# EAGLE board ControlBoardv1.3 (EAGLE 7.6.0), part 1 of 3
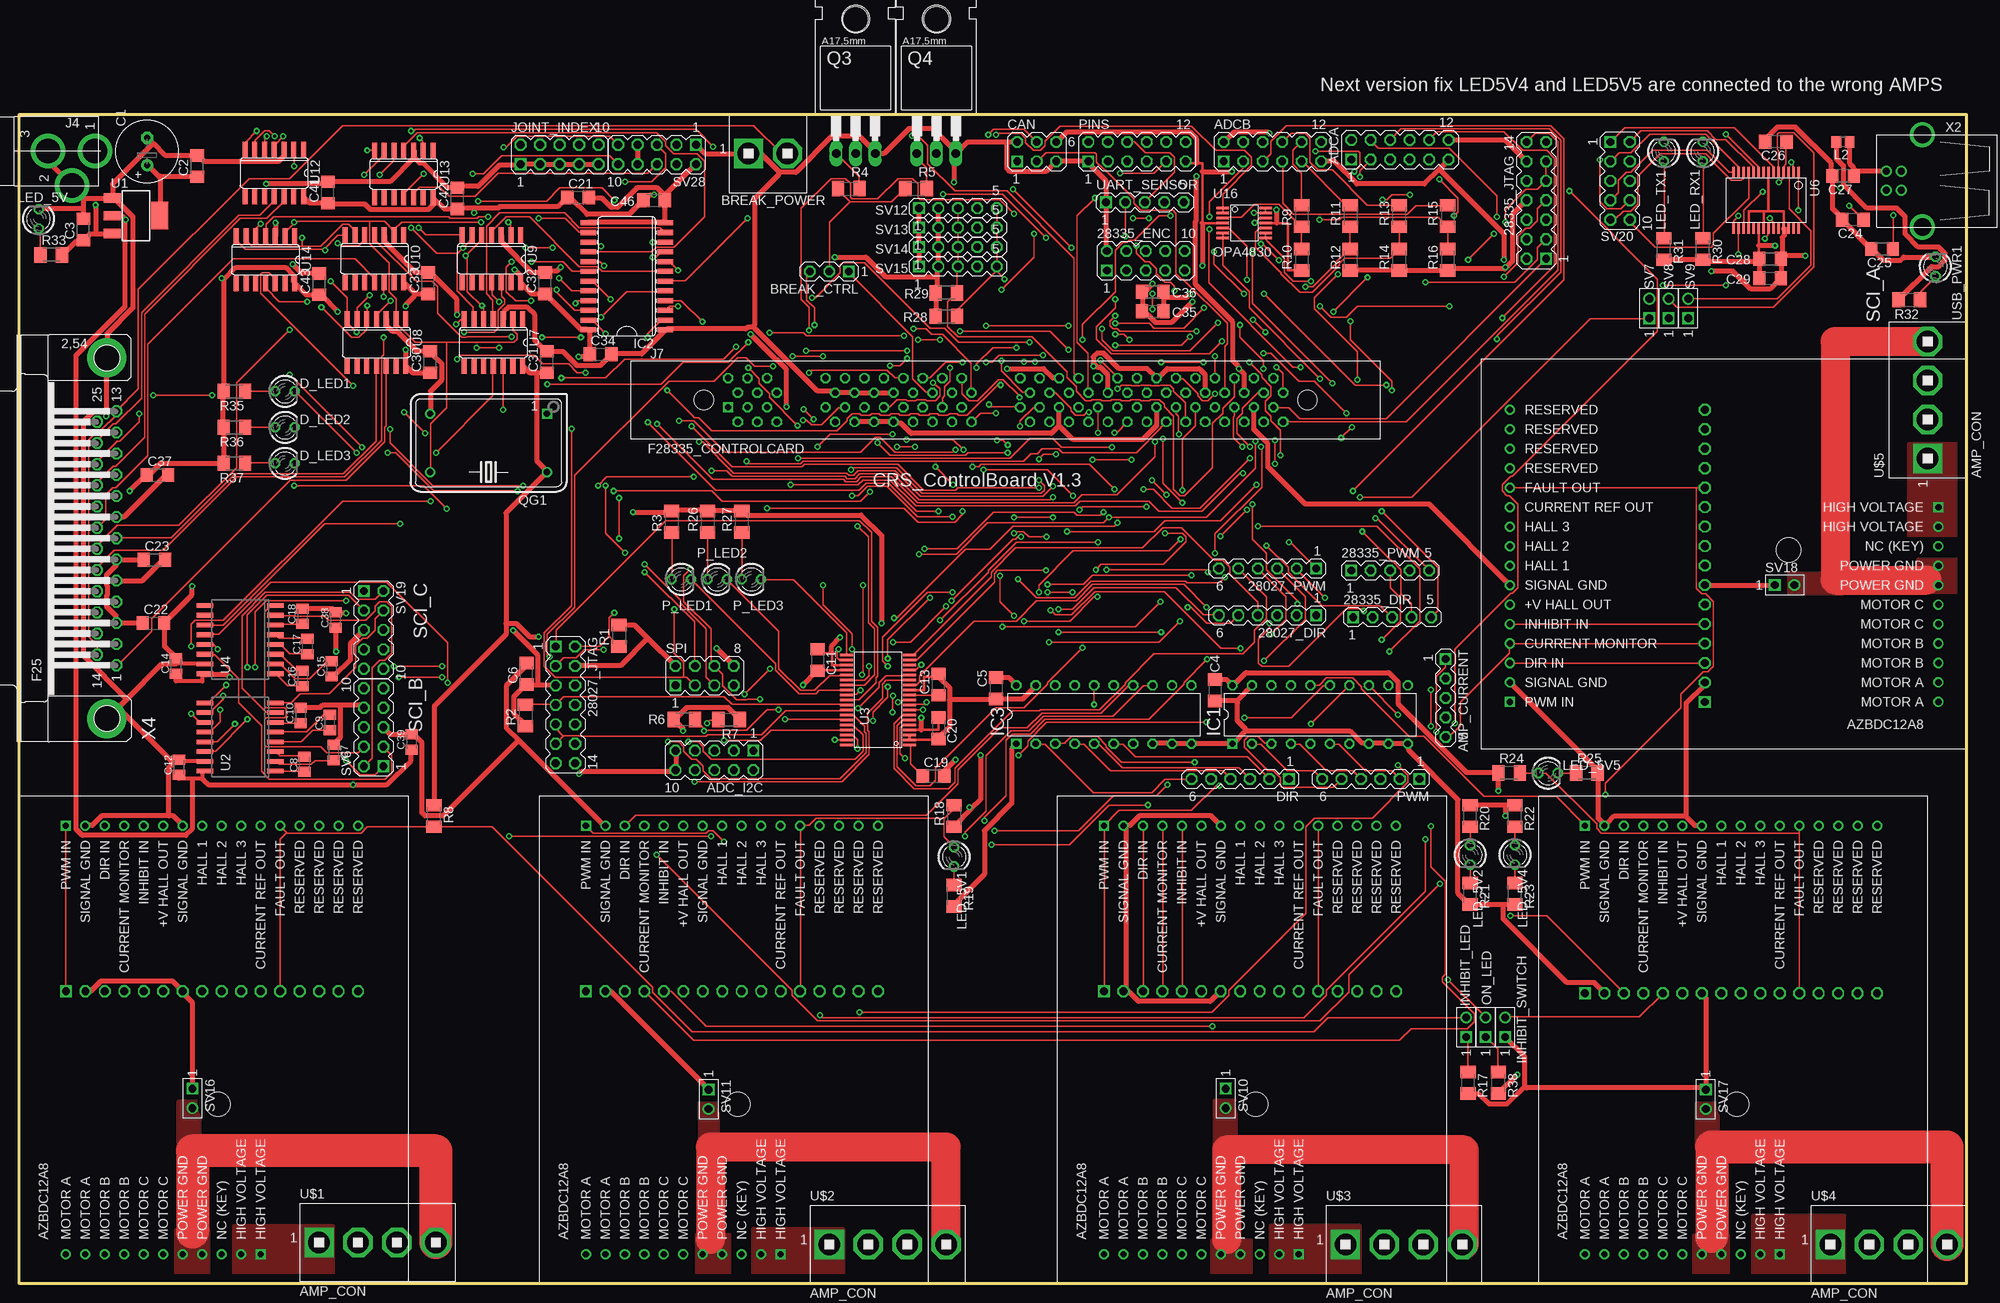
[diagram p6: board, top side]
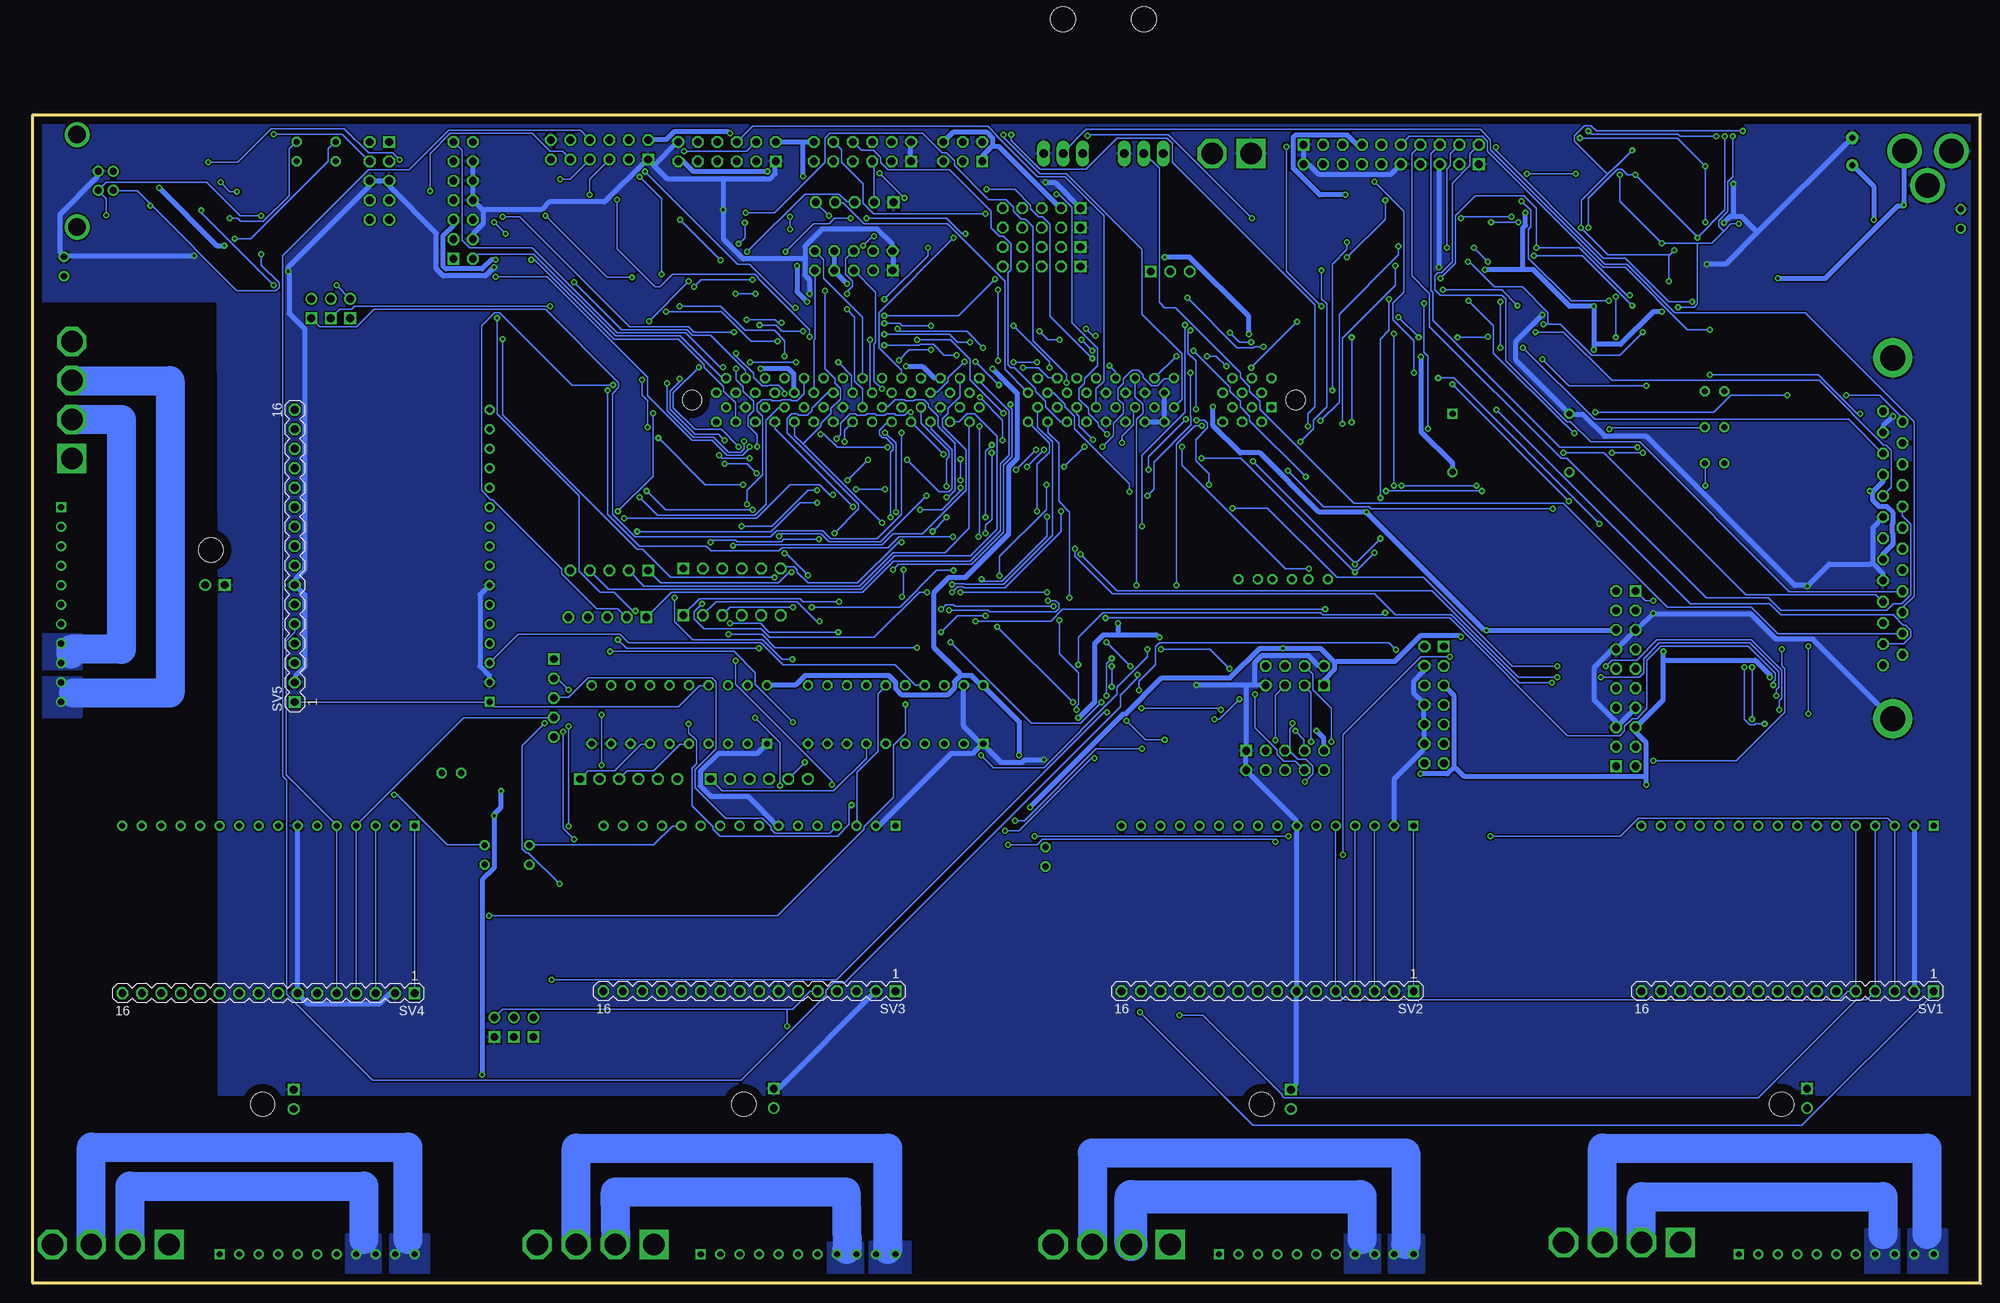
[diagram p7: board, bottom side, seen from below]

Size 254 x 152.4 mm. Coordinates in mm from the lower left corner, seen from the top.
Outline: 0,0 254,0 254,152.4 0,152.4 0,0
Copper layers (1*16): Top 0.035mm / dielectric 1.5mm / Bottom 0.035mm
Design rules "default": minimum track width 6mil, minimum drill 15mil, track to track 8mil, track to pad 8mil, pad to pad 8mil, via to via 8mil, smd to smd 8mil, copper to edge 40mil, drill to drill 8mil, minimum pad ring 10mil, minimum via ring 8mil, stop-mask expansion 4mil, vias tented up to drill 15mil, thermal gap 10mil
Net classes: 0 default: width 0.203 mm, drill 0.381 mm, clearance 0.203 mm; 1 supply: width 0.635 mm, drill 0.381 mm, clearance 0.203 mm

## Footprints (pad centres in the part's own frame; a part is rotated, then mirrored left to right if it is on the bottom)
MA06-1 = drill 1.016 square: 1 -6.35,0 | drill 1.016 octagon: 2 -3.81,0; 3 -1.27,0; 4 1.27,0; 5 3.81,0; 6 6.35,0
MA07-2 = drill 1.016 square: 1 -7.62,-1.27 | drill 1.016 octagon: 2 -7.62,1.27; 3 -5.08,-1.27; 4 -5.08,1.27; 5 -2.54,-1.27; 6 -2.54,1.27; 7 0,-1.27; 8 0,1.27; 9 2.54,-1.27; 10 2.54,1.27; 11 5.08,-1.27; 12 5.08,1.27; 13 7.62,-1.27; 14 7.62,1.27
MA05-1 = drill 1.016 square: 1 -5.08,0 | drill 1.016 octagon: 2 -2.54,0; 3 0,0; 4 2.54,0; 5 5.08,0
MA05-2 = drill 1.016 square: 1 -5.08,-1.27 | drill 1.016 octagon: 2 -5.08,1.27; 3 -2.54,-1.27; 4 -2.54,1.27; 5 0,-1.27; 6 0,1.27; 7 2.54,-1.27; 8 2.54,1.27; 9 5.08,-1.27; 10 5.08,1.27
MA06-2 = drill 1.016 square: 1 -6.35,-1.27 | drill 1.016 octagon: 2 -6.35,1.27; 3 -3.81,-1.27; 4 -3.81,1.27; 5 -1.27,-1.27; 6 -1.27,1.27; 7 1.27,-1.27; 8 1.27,1.27; 9 3.81,-1.27; 10 3.81,1.27; 11 6.35,-1.27; 12 6.35,1.27
AZBDC12A8 = drill 0.8 square: P_1 31.496,59.69; S_1 6.096,3.81 | drill 0.8: P_2 28.956,59.69; P_3 26.416,59.69; P_4 23.876,59.69; P_5 21.336,59.69; P_6 18.796,59.69; P_7 16.256,59.69; P_8 13.716,59.69; P_9 11.176,59.69; P_10 8.636,59.69; P_11 6.096,59.69; S_2 8.636,3.81; S_3 11.176,3.81; S_4 13.716,3.81; S_5 16.256,3.81; S_6 18.796,3.81; S_7 21.336,3.81; S_8 23.876,3.81; S_9 26.416,3.81; S_10 28.956,3.81; S_11 31.496,3.81; S_12 34.036,3.81; S_13 36.576,3.81; S_14 39.116,3.81; S_15 41.656,3.81; S_16 44.196,3.81 | hole 3.2: 25.908,40.132
MA03-1 = drill 1.016 square: 1 -2.54,0 | drill 1.016 octagon: 2 0,0; 3 2.54,0
BREAK_POWER_CON = drill 2.8 square: P$1 2.54,5.08 | drill 2.8 octagon: P$2 7.62,5.08
E3,5-8 = drill 0.813 pad 1.6: + -1.778,0 | drill 0.813 pad 1.6 octagon: - 1.778,0
C1206 = smd 1.6 x 1.8: 1 -1.4,0; 2 1.4,0
C0805K = smd 1.3 x 1.6: 1 -1,0; 2 1,0
MA03-2 = drill 1.016 square: 1 -2.54,-1.27 | drill 1.016 octagon: 2 -2.54,1.27; 3 0,-1.27; 4 0,1.27; 5 2.54,-1.27; 6 2.54,1.27
LED3MM = drill 0.813 octagon: A -1.27,0; K 1.27,0
DIL20 = drill 0.813 square: 1 -11.43,-3.81 | drill 0.813 octagon: 2 -8.89,-3.81; 3 -6.35,-3.81; 4 -3.81,-3.81; 5 -1.27,-3.81; 6 1.27,-3.81; 7 3.81,-3.81; 8 6.35,-3.81; 9 8.89,-3.81; 10 11.43,-3.81; 11 11.43,3.81; 12 8.89,3.81; 13 6.35,3.81; 14 3.81,3.81; 15 1.27,3.81; 16 -1.27,3.81; 17 -3.81,3.81; 18 -6.35,3.81; 19 -8.89,3.81; 20 -11.43,3.81
SO24W = smd 0.66 x 2.032: 1 -6.985,-5.029; 2 -5.715,-5.029; 3 -4.445,-5.029; 4 -3.175,-5.029; 5 -1.905,-5.029; 6 -0.635,-5.029; 7 0.635,-5.029; 8 1.905,-5.029; 9 3.175,-5.029; 10 4.445,-5.029; 11 5.715,-5.029; 12 6.985,-5.029; 13 6.985,5.029; 14 5.715,5.029; 15 4.445,5.029; 16 3.175,5.029; 17 1.905,5.029; 18 0.635,5.029; 19 -0.635,5.029; 20 -1.905,5.029; 21 -3.175,5.029; 22 -4.445,5.029; 23 -5.715,5.029; 24 -6.985,5.029
MA02-1 = drill 1.016 square: 1 -2.54,0 | drill 1.016: 2 0,0
JACK-PMS = drill 3.175 pad 4.5: 1 -0.5,-3.31; 2 -5,-0.31; 3 -0.5,2.809
MOLEX_DIMM_100 = drill 0.813 square: P$1 -36.195,-0.953 | drill 0.813 octagon: P$2 -34.925,-2.857; P$3 -33.655,-0.953; P$4 -32.385,-2.857; P$5 -31.115,-0.953; P$6 -29.845,-2.857; P$7 -23.495,-0.953; P$8 -22.225,-2.857; P$9 -20.955,-0.953; P$10 -19.685,-2.857; P$11 -18.415,-0.953; P$12 -17.145,-2.857; P$13 -15.875,-0.953; P$14 -14.605,-2.857; P$15 -13.335,-0.953; P$16 -12.065,-2.857; P$17 -10.795,-0.953; P$18 -9.525,-2.857; P$19 -8.255,-0.953; P$20 -6.985,-2.857; P$21 -5.715,-0.953; P$22 -4.445,-2.857; P$23 1.905,-0.953; P$24 3.175,-2.857; P$25 4.445,-0.953; P$26 5.715,-2.857; P$27 6.985,-0.953; P$28 8.255,-2.857; P$29 9.525,-0.953; P$30 10.795,-2.857; P$31 12.065,-0.953; P$32 13.335,-2.857; P$33 14.605,-0.953; P$34 15.875,-2.857; P$35 17.145,-0.953; P$36 18.415,-2.857; P$37 19.685,-0.953; P$38 20.955,-2.857; P$39 22.225,-0.953; P$40 23.495,-2.857; P$41 24.765,-0.953; P$42 26.035,-2.857; P$43 27.305,-0.953; P$44 28.575,-2.857; P$45 29.845,-0.953; P$46 31.115,-2.857; P$47 32.385,-0.953; P$48 33.655,-2.857; P$49 34.925,-0.953; P$50 36.195,-2.857; P$51 -36.195,2.857; P$52 -34.925,0.953; P$53 -33.655,2.857; P$54 -32.385,0.953; P$55 -31.115,2.857; P$56 -29.845,0.953; P$57 -23.495,2.857; P$58 -22.225,0.953; P$59 -20.955,2.857; P$60 -19.685,0.953; P$61 -18.415,2.857; P$62 -17.145,0.953; P$63 -15.875,2.857; P$64 -14.605,0.953; P$65 -13.335,2.857; P$66 -12.065,0.953; P$67 -10.795,2.857; P$68 -9.525,0.953; P$69 -8.255,2.857; P$70 -6.985,0.953; P$71 -5.715,2.857; P$72 -4.445,0.953; P$73 1.905,2.857; P$74 3.175,0.953; P$75 4.445,2.857; P$76 5.715,0.953; P$77 6.985,2.857; P$78 8.255,0.953; P$79 9.525,2.857; P$80 10.795,0.953; P$81 12.065,2.857; P$82 13.335,0.953; P$83 14.605,2.857; P$84 15.875,0.953; P$85 17.145,2.857; P$86 18.415,0.953; P$87 19.685,2.857; P$88 20.955,0.953; P$89 22.225,2.857; P$90 23.495,0.953; P$91 24.765,2.857; P$92 26.035,0.953; P$93 27.305,2.857; P$94 28.575,0.953; P$95 29.845,2.857; P$96 31.115,0.953; P$97 32.385,2.857; P$98 33.655,0.953; P$99 34.925,2.857; P$100 36.195,0.953 | hole 2.54: -39.37,0; 39.37,0
L0805 = smd 1.3 x 1.5: 1 -0.85,0; 2 0.85,0
TO220 = drill 1.118 long: 1 -2.54,-6.35; 2 0,-6.35; 3 2.54,-6.35 | hole 3.302: 0,11.176
DIL14S = drill 0.813 square: 1 -7.62,-3.81 | drill 0.813: 7 7.62,-3.81; 8 7.62,3.81; 14 -7.62,3.81
M1206 = smd 1.6 x 2: 1 -1.4,0; 2 1.4,0
MA04-2 = drill 1.016 square: 1 -3.81,-1.27 | drill 1.016 octagon: 2 -3.81,1.27; 3 -1.27,-1.27; 4 -1.27,1.27; 5 1.27,-1.27; 6 1.27,1.27; 7 3.81,-1.27; 8 3.81,1.27
AMP_HEADER = drill 1.016 square: 1 -20.32,1.27 | drill 1.016 octagon: 2 -17.78,1.27; 3 -15.24,1.27; 4 -12.7,1.27; 5 -10.16,1.27; 6 -7.62,1.27; 7 -5.08,1.27; 8 -2.54,1.27; 9 0,1.27; 10 2.54,1.27; 11 5.08,1.27; 12 7.62,1.27; 13 10.16,1.27; 14 12.7,1.27; 15 15.24,1.27; 16 17.78,1.27
SOT223 = smd 1.219 x 2.235: 1 -2.311,-3.099; 2 0,-3.099; 3 2.311,-3.099 | smd 3.6 x 2.2: 4 0,3.099
SO16W = smd 0.6 x 2.2: 1 -4.445,-4.6; 2 -3.175,-4.6; 3 -1.905,-4.6; 4 -0.635,-4.6; 5 0.635,-4.6; 6 1.905,-4.6; 7 3.175,-4.6; 8 4.445,-4.6; 9 4.445,4.6; 10 3.175,4.6; 11 1.905,4.6; 12 0.635,4.6; 13 -0.635,4.6; 14 -1.905,4.6; 15 -3.175,4.6; 16 -4.445,4.6
DA38 = smd 0.35 x 1.705: 1 -5.85,-4.12; 2 -5.2,-4.12; 3 -4.55,-4.12; 4 -3.9,-4.12; 5 -3.25,-4.12; 6 -2.6,-4.12; 7 -1.95,-4.12; 8 -1.3,-4.12; 9 -0.65,-4.12; 10 0,-4.12; 11 0.65,-4.12; 12 1.3,-4.12; 13 1.95,-4.12; 14 2.6,-4.12; 15 3.25,-4.12; 16 3.9,-4.12; 17 4.55,-4.12; 18 5.2,-4.12; 19 5.85,-4.12; 20 5.85,4.12; 21 5.2,4.12; 22 4.55,4.12; 23 3.9,4.12; 24 3.25,4.12; 25 2.6,4.12; 26 1.95,4.12; 27 1.3,4.12; 28 0.65,4.12; 29 0,4.12; 30 -0.65,4.12; 31 -1.3,4.12; 32 -1.95,4.12; 33 -2.6,4.12; 34 -3.25,4.12; 35 -3.9,4.12; 36 -4.55,4.12; 37 -5.2,4.12; 38 -5.85,4.12
SSOP28DB = smd 0.348 x 1.397: 1 -4.225,-3.656; 2 -3.575,-3.656; 3 -2.925,-3.656; 4 -2.275,-3.656; 5 -1.625,-3.656; 6 -0.975,-3.656; 7 -0.325,-3.656; 8 0.325,-3.656; 9 0.975,-3.656; 10 1.625,-3.656; 11 2.275,-3.656; 12 2.925,-3.656; 13 3.575,-3.656; 14 4.225,-3.656; 15 4.225,3.656; 16 3.575,3.656; 17 2.925,3.656; 18 2.275,3.656; 19 1.625,3.656; 20 0.975,3.656; 21 0.325,3.656; 22 -0.325,3.656; 23 -0.975,3.656; 24 -1.625,3.656; 25 -2.275,3.656; 26 -2.925,3.656; 27 -3.575,3.656; 28 -4.225,3.656
SO14 = smd 0.66 x 2.032: 1 -3.81,-3.073; 2 -2.54,-3.073; 3 -1.27,-3.073; 4 0,-3.073; 5 1.27,-3.073; 6 2.54,-3.073; 7 3.81,-3.073; 8 3.81,3.073; 9 2.54,3.073; 10 1.27,3.073; 11 0,3.073; 12 -1.27,3.073; 13 -2.54,3.073; 14 -3.81,3.073
OPA4830-TSSOP-14 = smd 0.35 x 1.6: P$1 0,0; P$2 0.65,0; P$3 1.3,0; P$4 1.95,0; P$5 2.6,0; P$6 3.25,0; P$7 3.9,0; P$8 3.9,5.6; P$9 3.25,5.6; P$10 2.6,5.6; P$11 1.95,5.6; P$12 1.3,5.6; P$13 0.65,5.6; P$14 0,5.6
APM_CON = drill 2.8 square: P$1 2.54,5.08 | drill 2.8 octagon: P$2 7.62,5.08; P$3 12.7,5.08; P$4 17.78,5.08
USB-B-H = drill 0.914: D+ 0,1.25; D- 1.981,1.25; GND 0,-1.25; VBUS 1.981,-1.25 | drill 2.286: P$1 -2.718,-6.02; P$2 -2.718,6.02
F25HP = drill 1.016 octagon: 1 -16.561,-1.27; 2 -13.792,-1.27; 3 -11.049,-1.27; 4 -8.28,-1.27; 5 -5.512,-1.27; 6 -2.769,-1.27; 7 0,-1.27; 8 2.769,-1.27; 9 5.512,-1.27; 10 8.28,-1.27; 11 11.049,-1.27; 12 13.792,-1.27; 13 16.561,-1.27; 14 -15.189,1.27; 15 -12.421,1.27; 16 -9.652,1.27; 17 -6.909,1.27; 18 -4.14,1.27; 19 -1.372,1.27; 20 1.372,1.27; 21 4.14,1.27; 22 6.909,1.27; 23 9.652,1.27; 24 12.421,1.27; 25 15.189,1.27 | drill 3.302 pad 5.08: G1 -23.52,0; G2 23.52,0

## Placement (x,y rotation side)
28027_DIR  [MA06-1]  162.81,87.12 180 top
28027_JTAG  [MA07-2]  71.25,75.44 270 top
28027_PWM  [MA06-1]  162.81,93.22 180 top
28335_DIR  [MA05-1]  179.07,86.87 0 top
28335_ENC  [MA05-2]  146.94,133.35 0 top
28335_JTAG  [MA07-2]  197.87,141.22 90 top
28335_PWM  [MA05-1]  178.82,92.96 0 top
ADC_I2C  [MA05-2]  90.68,68.2 180 top
ADCA  [MA06-2]  180.09,147.83 0 top
ADCB  [MA06-2]  163.45,147.57 0 top
AMP_1  AZBDC12A8THROUGH_HOLE  [AZBDC12A8]  0,63.5 180 bottom
AMP_2  AZBDC12A8THROUGH_HOLE  [AZBDC12A8]  67.82,63.5 180 bottom
AMP_3  AZBDC12A8THROUGH_HOLE  [AZBDC12A8]  135.38,63.5 180 bottom
AMP_4  AZBDC12A8THROUGH_HOLE  [AZBDC12A8]  198.12,63.5 180 bottom
AMP_5  AZBDC12A8THROUGH_HOLE  [AZBDC12A8]  190.63,69.72 90 bottom
AMP_CURRENT  [MA05-1]  186.06,76.33 270 top
BREAK_CTRL  [MA03-1]  105.66,131.95 180 top
BREAK_POWER  BREAK_POWER_CON  [BREAK_POWER_CON]  92.58,142.24 0 top
C1  100uF  [E3,5-8]  16.7,147.59 90 top
C2  10uF  [C1206]  23.21,145.69 90 top
C3  10uF  [C1206]  8.38,137.43 90 top
C4  0.1uF  [C1206]  155.96,77.34 270 top
C5  0.1uF  [C1206]  127.38,77.6 270 top
C6  0.1 uF  [C1206]  66.17,79.5 90 top
C7  0.1uF  [C0805K]  41.02,69.22 270 top
C8  0.1uF  [C0805K]  37.21,67.69 90 top
C9  0.1uF  [C0805K]  40.51,73.15 90 top
C10  0.1uF  [C0805K]  36.7,74.04 90 top
C11  2.2 uF  [C1206]  104.14,81.28 270 top
C12  0.1uF  [C0805K]  20.83,67.31 90 top
C13  2.2 uF  [C1206]  119.89,78.11 90 top
C14  0.1uF  [C0805K]  20.45,80.52 90 top
C15  0.1uF  [C0805K]  40.77,80.14 90 top
C16  0.1uF  [C0805K]  36.96,78.87 90 top
C17  0.1uF  [C0805K]  37.59,83.06 90 top
C18  0.1uF  [C0805K]  36.96,87 90 top
C19  2.2 uF  [C1206]  119.25,66.17 0 top
C20  2.2 uF  [C1206]  119.89,72.39 270 top
C21  0.1uF  [C1206]  72.9,141.6 0 top
C22  0.1uF  [C1206]  17.53,86.11 0 top
C23  0.1uF  [C1206]  17.65,94.36 0 top
C24  47pF  [C1206]  239.14,138.68 180 top
C25  47pF  [C1206]  242.95,134.87 180 top
C26  0.1uF  [C1206]  229.11,148.84 180 top
C27  10nF  [C1206]  237.87,144.4 180 top
C28  0.1uF  [C1206]  228.35,133.6 0 top
C29  4.7uF  [C1206]  228.35,131.06 0 top
C30  0.1uF  [C1206]  53.59,120.14 90 top
C31  0.1uF  [C1206]  68.83,120.14 90 top
C32  0.1uF  [C1206]  68.58,130.43 90 top
C33  0.1uF  [C1206]  53.34,130.43 90 top
C34  0.1uF  [C1206]  75.82,121.16 0 top
C35  0.1uF  [C1206]  147.83,126.75 0 top
C36  0.1uF  [C1206]  147.83,129.29 0 top
C37  0.1uF  [C1206]  18.03,105.41 0 top
C38  0.1uF  [C0805K]  41.27,86.49 90 top
C39  0.1uF  [C0805K]  51.18,70.61 90 top
C41  0.1uF  [C1206]  40.26,142.24 90 top
C42  0.1uF  [C1206]  57.15,141.48 90 top
C43  0.1uF  [C1206]  39.12,130.3 90 top
C46  0.1uF  [C1206]  82.8,141.22 0 top
CAN  [MA03-2]  132.72,147.57 0 top
D_LED1  [LED3MM]  34.67,116.33 0 top
D_LED2  [LED3MM]  34.67,111.63 0 top
D_LED3  [LED3MM]  34.67,106.93 0 top
DIR  [MA06-1]  159.26,65.79 180 top
IC1  74LS541N  [DIL20]  169.67,74.17 0 top
IC2  743384DW  [SO24W]  79.25,131.32 90 top
IC3  74LS541N  [DIL20]  141.48,74.17 0 top
INHIBIT_LED  [MA02-1]  188.72,34.67 90 top
INHIBIT_SWITCH  [MA02-1]  193.8,34.67 90 top
J4  [JACK-PMS]  6.57,148.15 90 top
J7  F28335_CONTROLCARD  [MOLEX_DIMM_100]  128.65,115.19 0 top
JOINT_INDEX  [MA05-2]  70.48,147.19 0 top
L2  BLM21PG221SN1D  [L0805]  237.87,148.84 180 top
LED_5V  [LED3MM]  2.54,138.81 90 top
LED_5V1  [LED3MM]  121.92,55.63 270 top
LED_5V2  [LED3MM]  189.23,55.88 270 top
LED_5V4  [LED3MM]  195.07,55.88 270 top
LED_5V5  [LED3MM]  199.39,66.55 0 top
LED_RX1  [LED3MM]  219.58,147.57 90 top
LED_TX1  [LED3MM]  214.5,147.57 90 top
ON_LED  [MA02-1]  191.26,34.67 90 top
P_LED1  [LED3MM]  86.36,91.82 0 top
P_LED2  [LED3MM]  91.06,91.82 0 top
P_LED3  [LED3MM]  95.5,91.82 0 top
PINS  [MA06-2]  145.8,147.57 0 top
PWM  [MA06-1]  176.28,65.79 180 top
Q3  TIP122  [TO220]  109.09,153.67 0 top
Q4  TIP122  [TO220]  119.63,153.67 0 top
QG1  [DIL14S]  61.21,109.6 180 top
R1  2.2K  [M1206]  78.23,84.45 90 top
R2  2.2K  [M1206]  66.04,74.04 90 top
R3  470  [M1206]  85.09,99.31 90 top
R4  470  [M1206]  108.2,142.75 180 top
R5  470  [M1206]  116.97,142.75 180 top
R6  4.7k  [M1206]  86.74,73.53 0 top
R7  4.7k  [M1206]  92.58,73.53 180 top
R8  470  [M1206]  54.1,60.96 270 top
R9  1.7x  [M1206]  167.26,139.19 90 top
R10  3.3x  [M1206]  167.26,133.48 90 top
R11  1.7x  [M1206]  173.61,139.19 90 top
R12  3.3x  [M1206]  173.61,133.48 90 top
R13  1.7x  [M1206]  179.96,139.19 90 top
R14  3.3x  [M1206]  179.96,133.48 90 top
R15  1.7x  [M1206]  186.31,139.19 90 top
R16  3.3x  [M1206]  186.31,133.48 90 top
R17  470  [M1206]  188.98,26.16 270 top
R18  470  [M1206]  121.92,60.96 90 top
R19  470  [M1206]  121.92,50.55 270 top
R20  470  [M1206]  189.23,60.96 270 top
R21  470  [M1206]  189.23,50.8 270 top
R22  470  [M1206]  195.07,60.96 270 top
R23  470  [M1206]  195.07,50.8 270 top
R24  470  [M1206]  194.31,66.55 0 top
R25  470  [M1206]  204.47,66.55 0 top
R26  470  [M1206]  89.79,99.31 90 top
R27  470  [M1206]  94.23,99.31 90 top
R28  10K  [M1206]  120.9,126.11 180 top
R29  10K  [M1206]  120.9,129.16 0 top
R30  470  [M1206]  219.58,134.87 270 top
R31  470  [M1206]  214.5,134.87 270 top
R32  470  [M1206]  246.51,128.27 180 top
R33  470  [M1206]  4.19,134.11 0 top
R35  470  [M1206]  28.07,116.33 180 top
R36  470  [M1206]  28.07,111.63 180 top
R37  470  [M1206]  28.07,106.93 180 top
R38  470  [M1206]  192.91,26.16 270 top
SPI  [MA04-2]  89.41,79.25 0 top
SV1  [AMP_HEADER]  26.42,39.37 180 bottom
SV2  [AMP_HEADER]  94.23,39.37 180 bottom
SV3  [AMP_HEADER]  161.8,39.37 180 bottom
SV4  [AMP_HEADER]  224.54,39.12 180 bottom
SV5  [AMP_HEADER]  218.57,96.14 90 bottom
SV6  [MA05-2]  46.23,72.52 90 top
SV7  [MA02-1]  212.6,128.4 90 top
SV8  [MA02-1]  215.14,128.4 90 top
SV9  [MA02-1]  217.68,128.4 90 top
SV10  [MA02-1]  157.35,22.86 270 top
SV11  [MA02-1]  89.92,22.73 270 top
SV12  [MA05-1]  122.43,140.21 0 top
SV13  [MA05-1]  122.43,137.67 0 top
SV14  [MA05-1]  122.43,135.13 0 top
SV15  [MA05-1]  122.43,132.59 0 top
SV16  [MA02-1]  22.61,22.86 270 top
SV17  [MA02-1]  219.96,22.73 270 top
SV18  [MA02-1]  231.52,91.06 0 top
SV19  [MA05-2]  46.23,85.22 270 top
SV20  [MA05-2]  208.79,143.76 270 top
SV28  [MA05-2]  83.19,147.19 180 top
U1  TLV1117-3.3V  [SOT223]  15.24,139.22 270 top
U2  MAX3232IDWR  [SO16W]  28.83,71.25 90 top
U3  F28027  [DA38]  112.01,76.07 90 top
U4  MAX3232IDWR  [SO16W]  28.83,83.95 90 top
U6  FT232RL  [SSOP28DB]  227.84,141.22 180 top
U7  [SO14]  61.85,122.68 180 top
U8  [SO14]  46.61,122.68 180 top
U9  [SO14]  61.59,133.6 180 top
U10  [SO14]  46.35,133.6 180 top
U12  [SO14]  33.27,144.78 180 top
U13  [SO14]  50.16,144.65 180 top
U14  [SO14]  32.13,133.48 180 top
U16  OPA4830  [OPA4830-TSSOP-14]  156.97,140.21 270 top
U$1  AMP_CON  [APM_CON]  36.58,0.25 0 top
U$2  AMP_CON  [APM_CON]  103.12,0 0 top
U$3  AMP_CON  [APM_CON]  170.43,0 0 top
U$4  AMP_CON  [APM_CON]  233.68,0 0 top
U$5  AMP_CON  [APM_CON]  254,105.03 90 top
UART_SENSOR  [MA05-1]  146.81,140.97 0 top
USB_PWR1  [LED3MM]  249.94,132.59 90 top
X2  [USB-B-H]  245.49,143.76 180 top
X4  [F25HP]  11.43,97.16 90 top

## Tracks (layer width: path | path; a pad name or v marks a point on that pad's centre or on a via)
28027_ADCA2
  Top 0.203: U3.20 107.9,81.99 107.9,84.84 100.99,91.75 96.83,91.75 P_LED3.K
28027_ADCB2
  Top 0.203: U3.24 107.8,79.25 105.66,79.25 103.73,77.32 101.91,77.32 99.06,80.16 99.06,85.04 92.35,91.75 P_LED2.K
28027_BREAK  (via drill 0.38)
  Top 0.203: v109.32,98.75 110.74,97.33 110.74,86.16 111.56,85.34 111.56,79.35 110.24,78.03 U3.26 | v103.73,124.97 103.73,127.2 102.72,128.22 102.72,131.47 103.12,131.88 BREAK_CTRL.3
  Bottom 0.203: v109.32,98.75 109.32,108 103.73,113.59 v103.73,124.97
28027_DIR1  (via drill 0.38)
  Top 0.203: v118.36,75.79 118.06,75.49 116.23,75.49 U3.9 | v128.22,85.65 145.59,85.65 v148.84,88.9
  Bottom 0.203: v128.22,85.65 v118.36,75.79 | v148.84,88.9 153.52,88.9 153.92,89.31 167.03,89.31 169.16,87.17 28027_DIR.1
28027_DIR2  (via drill 0.38)
  Top 0.203: v114.61,75.79 114.81,76 116.13,76 U3.10 | v134.31,83.62 148.64,83.62 v151.38,86.36
  Bottom 0.203: v114.61,75.79 117.35,73.05 123.75,73.05 v134.31,83.62 | v151.38,86.36 151.79,86.36 154.33,88.9 164.9,88.9 166.62,87.17 28027_DIR.2
28027_DIR3  (via drill 0.38)
  Top 0.203: v154.84,88.19 151.89,91.14 140,91.14 137.87,89 132.69,89 130.05,86.36 124.56,86.36 117.45,79.25 117.45,78.44 117.04,78.03 116.23,78.03 U3.13
  Bottom 0.203: v154.84,88.19 163.07,88.19 164.08,87.17 28027_DIR.3
28027_DIR4
  Top 0.203: 28027_DIR.4 161.54,88.8 157.89,92.46 157.89,93.37 156.97,94.28 155.85,94.28 151.59,98.55 149.15,98.55 146.51,95.91 129.95,95.91 126.8,92.76 126.8,92.15 116.64,81.99 116.23,81.99 U3.19
28027_DIR5  (via drill 0.38)
  Top 0.203: v133.91,92.96 127.61,92.96 127.2,92.56 127.2,91.44 117.04,81.28 116.23,81.28 U3.18 | v152.4,88.19 152.81,88.19 154.94,86.06 157.99,86.06 159,87.07 28027_DIR.5
  Bottom 0.203: v133.91,92.96 136.14,92.96 140.92,88.19 v152.4,88.19
28027_DIR6  (via drill 0.38)
  Top 0.203: v110.85,80.47 110.85,79.25 110.24,78.64 107.9,78.64 U3.25 | v114,83.62 116.23,83.62 v120.9,88.29 | v135.53,87.88 137.36,87.88 140.21,90.73 150.88,90.73 154.43,87.17 156.46,87.17 28027_DIR.6
  Bottom 0.203: v114,83.62 v110.85,80.47 | v120.9,88.29 133.71,88.29 133.91,88.49 134.93,88.49 v135.53,87.88
28027_GPIO34
  Top 0.203: U3.27 107.8,77.32 104.34,77.32 103.94,76.91 101.7,76.91 98.65,79.96 98.65,80.77 87.68,91.75 P_LED1.K
28027_PWM1A  (via drill 0.38)
  Top 0.203: v106.38,70.92 107.8,70.92 U3.37 | v111.35,73.36 111.35,74.47 113.28,76.4 v113.28,77.83 | v113.28,80.47 112.57,81.18 112.57,84.23 118.47,90.12 v121.72,90.12 | v132.99,90.12 132.99,91.03 137.47,95.5 149.96,95.5 v151.49,97.03 | v165.61,96.62 165.81,96.62 169.16,93.27 28027_PWM.1
  Bottom 0.203: v106.38,70.92 108.92,70.92 v111.35,73.36 | v113.28,80.47 v113.28,77.83 | v132.99,90.12 v121.72,90.12 | v151.49,97.03 156.06,97.03 156.36,96.72 162.15,96.72 162.36,96.93 165.3,96.93 v165.61,96.62
28027_PWM1B  (via drill 0.38)
  Top 0.203: v109.32,69.7 109.32,70.92 108.81,71.42 107.9,71.42 U3.36 | v125.88,60.35 125.88,60.76 128.73,63.6 128.73,70.81 129.54,71.63 131.88,71.63 133.81,73.56 147.32,73.56 151.89,78.13 151.89,78.33 v154.94,81.38 | v170.28,89.41 166.62,93.07 28027_PWM.2
  Bottom 0.203: v109.32,69.7 115.32,69.7 124.66,60.35 v125.88,60.35 | v154.94,81.38 156.26,81.38 158.8,83.92 167.94,83.92 170.28,86.26 v170.28,89.41
28027_PWM2A  (via drill 0.38)
  Top 0.203: v115.52,68.48 114.91,69.09 114.91,72.44 115.21,72.75 116.13,72.75 U3.5 | v127.2,59.03 138.18,59.03 142.75,63.6 148.34,63.6 v149.76,65.02 | v162.36,81.18 167.74,86.56 167.74,89.51 164.08,93.17 28027_PWM.3
  Bottom 0.203: v115.52,68.48 115.93,68.48 125.37,59.03 v127.2,59.03 | v149.76,65.02 149.76,65.53 162.36,78.13 v162.36,81.18
28027_PWM2B  (via drill 0.38)
  Top 0.203: v138.68,82.91 134.11,78.33 134.11,78.13 131.06,75.08 127.41,75.08 119.48,67.16 119.48,65.63 118.77,64.92 116.94,64.92 114.5,67.36 114.5,72.75 115.21,73.46 116.13,73.46 U3.6 | v163.27,84.63 165.2,86.56 165.2,89.51 161.54,93.17 28027_PWM.4
  Bottom 0.203: v138.68,82.91 157.18,82.91 158.9,84.63 v163.27,84.63
28027_PWM3A
  Top 0.203: U3.7 116.13,74.07 115.21,74.07 114.1,72.95 114.1,67.16 116.74,64.52 121.21,64.52 122.02,65.33 122.02,67.16 129.54,74.68 133.1,74.68 133.2,74.78 140.92,74.78 144.27,78.13 144.27,78.33 148.03,82.09 159.61,82.09 161.14,83.62 161.14,85.14 162.66,86.67 162.66,89.51 159,93.17 28027_PWM.5
28027_PWM3B  (via drill 0.38)
  Top 0.203: v117.86,74.78 116.23,74.78 U3.8 | v120.09,86.46 126.39,92.76 126.39,92.96 130.05,96.62 v140.72,96.62
  Bottom 0.203: v117.86,74.78 117.86,75.29 117.65,75.49 117.65,79.65 120.09,82.09 v120.09,86.46 | v140.72,96.62 141.12,96.62 146.41,91.34 152.91,91.34 154.33,92.76 154.33,93.07 154.74,93.47 156.26,93.47 156.46,93.27 28027_PWM.6
28027_SCL  (via drill 0.38)
  Top 0.203: v109.42,74.98 112.17,77.72 112.17,78.33 113.08,79.25 116.13,79.25 U3.15 | v99.06,74.78 97.54,74.78 94.89,72.14 89.51,72.14 89.46,72.19 | 89.46,72.19 88.19,73.46 R6.2 | 89.46,72.19 v89.31,72.03
  Bottom 0.203: v109.42,74.98 99.26,74.98 v99.06,74.78 | v89.31,72.03 88.19,70.92 88.19,69.49 ADC_I2C.7
28027_SDA  (via drill 0.38)
  Top 0.203: v88.09,65.43 107.29,65.43 110.85,68.99 110.85,71.93 110.64,72.14 110.64,74.37 112.57,76.3 112.57,78.13 113.08,78.64 116.13,78.64 U3.14 | v89.71,73.05 90.12,73.46 91.14,73.46 R7.2
  Bottom 0.203: v88.09,65.43 87.07,66.45 87.07,67.46 87.99,68.38 89,68.38 90.02,69.39 | 90.02,69.39 90.63,69.39 ADC_I2C.5 90.02,69.39 | v89.71,73.05 89.71,72.64 90.02,72.34 90.02,69.39
28027_TCK
  Top 0.203: 70.97,71.37 70,70.41 28027_JTAG.11 | 70.97,71.37 71.02,71.42 73.05,71.42 73.15,71.32 89.61,71.32 89.81,71.53 96.83,71.53 99.97,74.68 107.8,74.68 U3.31 | 70.97,71.37 70,72.34 70,72.85 28027_JTAG.9
28027_TDI  (via drill 0.38)
  Top 0.203: v109.73,77.32 109.22,76.81 107.9,76.81 U3.28 | v76.2,82.6 73.66,82.6 72.64,81.58 71.02,81.58 70,80.57 28027_JTAG.3
  Bottom 0.203: v109.73,77.32 109.73,78.54 107.59,80.67 107.59,83.01 107.09,83.52 77.11,83.52 v76.2,82.6
28027_TDO
  Top 0.203: U3.30 107.8,75.49 92.96,75.49 91.95,76.5 71.02,76.5 70,75.49 28027_JTAG.7 69.9,75.49 66.04,75.49 R2.2
28027_TMS
  Top 0.203: U3.29 107.9,76.1 109.53,76.1 111.76,78.33 111.76,78.94 111.96,79.15 111.96,85.55 111.15,86.36 111.15,97.94 109.63,99.47 84.33,99.47 70,85.14 70,83.11 28027_JTAG.1
28027_TRSTN  (via drill 0.38)
  Top 0.203: v117.65,80.67 117.04,80.06 116.23,80.06 U3.16 | v77.62,87.48 76.91,86.77 76.91,84.43 76.96,84.38 | 76.96,84.38 78.23,83.11 R1.1 | 76.96,84.38 75.69,83.11 72.54,83.11 28027_JTAG.2
  Bottom 0.203: v117.65,80.67 117.65,84.23 114.4,87.48 86.06,87.48 85.75,87.17 77.93,87.17 v77.62,87.48
28335_BREAK
  Top 0.203: BREAK_CTRL.1 108.2,131.78 116.53,123.44 116.53,117.96 118.26,116.23 119.08,116.23 J7.P$68
28335_EMU0  (via drill 0.38)
  Top 0.203: v163.98,119.48 164.79,118.67 164.79,116.23 J7.P$100
  Bottom 0.203: v163.98,119.48 164.39,119.48 168.86,123.95 177.8,123.95 188.87,135.03 197,135.03 198.02,136.04 198.02,147.73 28335_JTAG.13
28335_EMU1
  Top 0.203: 28335_JTAG.14 197.71,149.96 199.54,149.96 200.66,148.84 200.66,132.08 180.95,112.37 164.9,112.37 J7.P$50
28335_GPIO16  (via drill 0.38)
  Top 0.203: v91.95,70.81 96.72,70.81 98.04,72.14 107.8,72.14 U3.35 | v77.11,128.32 74.78,130.66 74.27,130.66 IC2.19 | v78.23,97.13 v78.23,102.41 | v81.58,93.78 86.26,89.1 86.26,88.7 89.61,85.34 89.61,79.05 SPI.5 | v94.89,107.19 95.2,106.88 101.91,106.88 102.21,107.19 130.96,107.19 131.98,108.2 132.79,108.2 133.4,108.81 135.53,108.81 136.04,108.31 145.69,108.31 148.95,111.56 148.95,111.66 149.56,112.27 J7.P$38
  Bottom 0.203: v91.95,70.81 91.95,76.71 SPI.5 | v77.11,128.32 77.11,124.26 78.23,123.14 v78.23,102.41 | v78.23,97.13 v81.58,93.78 81.58,93.88 v94.89,107.19
28335_GPIO17  (via drill 0.38)
  Top 0.203: v87.27,70.61 88.59,70.61 89.2,70 89.2,69.39 90.22,68.38 109.02,68.38 110.03,69.39 110.03,71.53 108.81,72.75 107.9,72.75 U3.34 | v72.54,127.81 72.85,128.12 74.17,128.12 IC2.21 | v72.03,111.45 72.03,88.39 68.48,84.84 68.48,80.47 69.9,79.05 86.67,79.05 | 86.67,79.05 87.07,79.05 SPI.3 | v149.45,97.84 151.69,97.84 152.2,97.33 152.2,96.72 149.25,93.78 141.12,93.78 v140.41,93.07 | v140.61,89.51 140.21,89.51 137.06,86.36 v131.06,86.36 | v85.45,87.88 85.45,82.19 86.67,80.97 86.67,79.05
  Bottom 0.203: v87.27,70.61 87.27,77.01 88.19,77.93 SPI.3 | v72.54,127.81 72.54,121.41 72.03,120.9 v72.03,111.45 | v149.45,97.84 146.3,100.99 146.3,101.6 155.65,110.95 155.65,112.78 155.04,113.39 154.33,113.39 154.13,113.18 153.01,113.18 152.4,113.79 152.4,114.1 150.37,116.13 149.66,116.13 J7.P$88 | v140.41,93.07 140.41,89.71 v140.61,89.51 | v131.06,86.36 121.21,86.36 119.69,87.88 v85.45,87.88
28335_GPIO18  (via drill 0.38)
  Top 0.203: v84.63,70.61 86.06,70.61 86.67,70 86.67,69.39 87.68,68.38 88.29,68.38 89.2,67.46 89.2,66.85 90.22,65.84 107.09,65.84 110.44,69.19 110.44,71.73 110.24,71.93 110.24,72.64 108.81,74.07 107.9,74.07 U3.32 | v76.5,123.85 74.78,125.58 74.27,125.58 IC2.23 | v76.5,104.04 76.5,97.84 v79.05,95.3 | v81.58,92.76 88.09,86.26 88.09,80.57 SPI.4 | J7.P$39 150.88,113.39 151.18,113.08 151.18,110.85 v151.28,110.74 | v142.54,109.02 135.94,109.02 134.82,110.13 131.78,110.13 129.24,107.59 v101.6,107.59
  Bottom 0.203: v84.63,70.61 84.63,74.98 87.07,77.42 87.07,79.45 SPI.4 | v76.5,104.04 v76.5,123.85 | v79.05,95.3 v81.58,92.76 96.42,107.59 v101.6,107.59 | v151.28,110.74 150.77,110.74 149.05,109.02 v142.54,109.02
28335_GPIO85  (via drill 0.38)
  Top 0.203: v99.87,73.56 107.8,73.56 U3.33 | v96.62,76.2 95,76.2 94.89,76.1 93.57,76.1 91.75,77.93 91.75,79.45 SPI.6 90.22,80.97 90.22,85.34 86.67,88.9 86.67,92.25 v87.58,93.17 | v133.91,136.35 128.22,142.04 v120.5,142.04 | v113.89,110.74 105.77,110.74 v104.14,109.12
  Bottom 0.203: v99.87,73.56 99.26,73.56 v96.62,76.2 | J7.P$81 140.72,119.08 143.66,122.02 143.66,126.59 v133.91,136.35 | v120.5,142.04 120.19,142.04 118.47,140.31 118.47,125.27 115.11,121.92 115.11,119.69 116.84,117.96 116.84,117.35 117.55,116.64 117.55,115.32 116.33,114.1 116.33,113.49 115.01,112.17 115.01,111.86 v113.89,110.74 | v104.14,109.12 104.14,106.68 90.63,93.17 v87.58,93.17
28335_TCK  (via drill 0.38)
  Top 0.203: v192.33,136.85 v188.98,133.5 | v193.85,138.38 193.85,140 196.49,142.65 198.02,142.65 28335_JTAG.9 28335_JTAG.11
  Bottom 0.203: v188.98,133.5 188.57,133.5 178.21,123.14 169.77,123.14 166.42,119.79 166.42,119.48 163.88,116.94 163.88,116.33 162.36,114.81 162.36,112.37 J7.P$48 | v193.85,138.38 v192.33,136.85
28335_TDI  (via drill 0.38)
  Top 0.203: v183.39,130.56 195.07,130.56 198.02,133.5 198.02,135.03 28335_JTAG.3
  Bottom 0.203: J7.P$97 161.04,119.08 165.61,123.65 167.94,123.65 168.66,124.36 177.19,124.36 v183.39,130.56
28335_TDO  (via drill 0.38)
  Top 0.203: v160.53,109.12 158.8,110.85 158.8,112.78 159.51,113.49 159.51,114.1 161.54,116.13 162.25,116.13 J7.P$98 | v193.65,131.27 195.48,133.1 195.48,136.55 196.49,137.57 197,137.57 198.02,138.58 198.02,140.11 28335_JTAG.7
  Bottom 0.203: v160.53,109.12 160.53,108.92 161.44,108 163.47,108 165.41,109.93 168.05,109.93 173.84,115.72 173.84,118.16 186.94,131.27 v193.65,131.27
28335_TMS
  Top 0.203: 28335_JTAG.1 178.31,112.78 167.03,112.78 165.61,114.2 163.58,114.2 J7.P$49
28335_TRSTN
  Bottom 0.203: 28335_JTAG.2 195.99,134.21 188.67,134.21 178,123.55 169.57,123.55 164.08,118.06 J7.P$99
+3.3V  (via drill 0.38)
  Top 0.305: U3.22 106.05,80.62 106.05,82.17 104.14,82.17 C11.1 | U3.4 117.65,72.17 119.89,72.17 C20.1
  Top 0.356: U16.P$4 154.31,138.26 154.31,144.98 154.31,146.05 153.52,146.05 152.15,146.05 PINS.11
  Top 0.508: U2.16 23.88,66.8 23.88,65.79 22.55,65.79 20.83,65.79 C12.1 | U4.16 23.88,79.5 23.88,78.49 20.45,78.49 C14.1
  Top 0.635: v41.35,82.4 41.35,85.45 C38.1 | v27.43,79.05 27.13,79.35 24.38,79.35 U4.16 | 18.39,144.37 18.19,144.37 16.76,145.8 C1.+ | 18.39,144.37 23.16,144.37 C2.1 | U1.2 12.19,139.19 13.41,139.19 v13.92,138.68 13.82,138.38 13.82,127.41 7.42,121.01 7.42,59.23 8.23,58.42 21.74,58.42 22.55,59.23 22.55,65.79 | 18.39,144.37 18.39,139.29 U1.4 | C39.1 51.1,69.6 51.1,68.17 47.95,65.02 v43.59,65.02 24.69,65.02 24.08,65.63 23.88,65.79 | ADCB.11 171.5,146.3 174.45,143.36 183.29,143.36 185.22,145.29 | 185.22,145.29 186.44,146.51 ADCA.11 | v193.65,133.5 193.65,136.85 185.22,145.29 | v147.83,130.35 146.81,129.34 C36.1 146.51,129.24 146.51,126.8 C35.1 146.81,126.69 148.23,125.27 150.27,125.27 v153.01,128.02 | v154.33,132.69 154.33,138.18 154.31,138.26 | R28.2 119.58,126.19 119.58,129.13 R29.1 119.69,129.44 119.69,131.27 | 119.69,131.27 119.69,132.38 SV15.2 SV14.2 SV13.2 SV12.2 | 153.52,146.05 153.52,149.35 152.71,150.16 136.65,150.16 135.33,148.84 CAN.6 | 154.31,144.98 v158.19,144.98 | v117.65,73.76 117.65,72.17 | v107.09,84.23 105.97,83.11 105.97,82.3 106.05,82.17 | ADC_I2C.9 85.65,69.39 85.65,66.95 ADC_I2C.10 85.34,66.75 73.36,66.75 v73.05,66.45 | R7.1 93.98,73.56 92.46,75.08 87.07,75.08 85.55,73.56 85.34,73.56 R6.1 85.65,73.25 86.56,72.34 v86.56,72.03 | 67.67,78.03 69.9,78.03 28027_JTAG.5 | 67.67,78.03 66.24,78.03 C6.1 65.94,77.93 64.52,76.5 64.52,74.37 66.04,72.85 R2.1 | v64.41,85.14 67.67,81.89 67.67,78.03 | v80.06,100.58 84.84,100.58 R3.2 85.14,100.79 89.71,100.79 R26.2 90.02,100.79 94.18,100.79 R27.2 94.49,100.58 94.89,100.18 109.83,100.18 112.47,97.54 v112.47,86.06
  Top 0.635: 119.69,131.27 112.98,131.27 110.44,133.81 v106.38,133.81 | v95.4,123.75 98.65,120.5 98.75,120.5 100.08,119.18 v100.08,114.3
  Bottom 0.635: 41.35,81.28 41.35,76.1 44.91,72.54 SV6.6 44.81,72.24 44.81,71.73 43.59,70.51 43.59,66.14 | 41.35,81.28 v41.35,82.4 | v27.43,79.05 27.43,79.35 29.36,81.28 41.35,81.28 | v13.92,138.68 13.92,143.05 16.66,145.8 C1.+ | v43.59,65.02 43.59,66.14 | 28335_JTAG.5 199.14,137.97 200.46,136.65 200.46,132.59 200.15,132.28 195.38,132.28 194.16,133.5 v193.65,133.5 | v147.83,130.35 149.56,132.08 28335_ENC.7 149.45,132.38 149.45,134.62 28335_ENC.8 | v153.01,128.02 154.33,129.34 v154.33,132.69 | 128.83,148.34 130.15,147.01 130.15,146.3 CAN.1 | 128.83,148.34 128.83,149.35 129.64,150.16 133.91,150.16 135.23,148.84 CAN.6 | SV12.2 119.99,140.21 128.02,148.23 128.52,148.23 128.83,148.34 | ADCB.11 169.16,146.3 167.84,144.98 v158.19,144.98 | v117.65,73.76 117.55,73.76 115.52,75.79 115.52,83.41 114.4,84.53 112.47,84.53 | 112.47,84.53 107.39,84.53 v107.09,84.23 | v86.56,72.03 85.65,71.12 85.65,69.49 ADC_I2C.9 | SV19.6 47.55,85.14 v64.41,85.14 64.72,85.24 v80.06,100.58 86.26,100.58 93.98,108.31 96.52,108.31 100.08,111.86 v100.08,114.3 | v73.05,66.45 69.49,66.45 68.68,67.26 | 68.68,67.26 68.68,76.71 69.9,77.93 28027_JTAG.5 | v112.47,86.06 112.47,84.53 | v106.38,133.81 103.12,133.81 95.4,126.09 v95.4,123.75 | 43.59,66.14 67.36,66.14 68.38,67.16 68.68,67.26
+5V  (via drill 0.38)
  Top 0.635: SPI.8 v90.93,82.8 | 67.56,118.77 66.55,118.77 65.73,119.58 U7.14 | 67.56,118.77 68.78,118.77 C31.1 | 63.5,86.06 63.5,100.48 68.78,105.77 QG1.14 68.68,106.07 67.56,107.19 67.56,118.77 | 63.5,86.06 63.5,84.63 54.15,75.29 54.15,62.38 R8.1 | v67.77,84.33 66.55,84.33 64.82,86.06 63.5,86.06 | U12.14 37.08,141.63 37.8,140.92 40.23,140.92 C41.1 40.54,140.72 45.11,140.72 45.82,140 53.34,140 54.25,140.92 U13.14 54.05,141.53 55.47,140.11 57.1,140.11 C42.1 57.4,140.21 59.33,140.21 | SV28.8 80.67,146 80.67,148.44 SV28.7 | v82.8,141.94 82.3,141.94 81.69,141.33 C46.1 81.38,141.22 79.55,139.4 74.07,139.4 71.93,141.53 71.53,141.53 C21.1 71.22,141.43 70.21,140.41 62.69,140.41 62.48,140.21 59.33,140.21 | R33.2 5.69,134.11 7.52,135.94 8.33,135.94 C3.1 8.64,136.25 9.25,136.85 9.96,136.85 | 9.96,136.85 12.09,136.85 U1.3 | v9.96,140.61 9.96,136.85 | C22.1 16.05,86.16 12.7,86.16 X4.3 12.6,86.46 12.6,87.07 11.38,88.29 11.38,89.61 11.48,89.71 11.48,91.03 11.38,91.14 11.38,92.35 12.6,93.57 12.6,94.08 X4.6 16.15,94.39 C23.1 | C30.1 53.54,118.77 51.31,118.77 50.49,119.58 U8.14 50.39,119.89 v50.39,121.72 | 51.61,129.03 C33.1 | 51.61,129.03 50.19,130.45 U10.14 | v50.39,127.41 50.39,127.61 51.51,128.73 51.61,129.03 | 26.72,130.96 28.25,132.49 34.75,132.49 35.76,131.47 35.76,130.66 U14.14 35.97,130.35 37.39,128.93 39.12,128.93 C43.1 39.42,128.83 v41.55,126.69 | 26.72,130.96 26.72,116.64 R35.2 26.62,116.33 26.62,111.96 R36.2 26.72,111.56 26.72,107.19 R37.2 26.62,106.88 18.39,106.88 16.97,105.46 16.66,105.46 C37.1 16.36,105.26 v14.43,103.33 | v64.62,132.18 65.43,131.37 65.43,130.86 U9.14 65.43,130.45 66.85,129.03 C32.1 68.78,128.83 73.15,124.46 73.97,124.46 IC2.24 74.27,124.26 74.37,124.16 74.37,121.21 C34.1 74.07,121.11 73.76,120.8 v72.95,120.8
  Top 0.635: v26.42,131.06 26.72,130.96 | v59.33,139.6 59.33,140.21 | v163.07,149.96 162.87,150.16 158.5,150.16 157.18,148.84 ADCB.2 | 140.31,119.79 140.11,119.99 140.11,120.8 140.61,121.31 141.43,121.31 143.46,119.28 147.12,119.28 J7.P$87 148.64,118.16 149.76,119.28 153.92,119.28 154.63,118.57 154.63,116.23 J7.P$92 | 140.31,119.79 140.61,119.48 141.02,119.48 141.94,118.57 141.94,116.23 J7.P$82 | J7.P$96 159.72,116.23 159.72,118.67 v159.11,119.28 159,119.58 158.29,120.29 158.29,125.37 153.42,130.25 153.42,138.48 153.52,138.58 v153.52,144.37 | v140.11,119.58 140.31,119.79 | 193.85,62.38 195.07,62.38 R22.1 | 193.85,62.38 189.28,62.38 R20.1 | v195.38,27.23 192.94,24.79 R38.2 | 193.85,62.38 v193.85,60.96 | v192.94,64.21 192.94,66.55 R24.1 192.63,66.65 188.77,66.65 179.83,75.59 179.83,78.44 178.61,79.65 160.02,79.65 158.5,78.13 IC1.20 157.48,78.74 C4.1 | C5.1 127.41,78.94 129.13,78.94 130.05,78.03 IC3.20 | 124.16,61.87 125.37,63.09 v125.37,68.89 | 124.16,61.87 121.92,59.64 R18.1 | v128.83,119.28 133.6,119.28 134.82,118.06 J7.P$77 | v123.95,62.08 124.16,61.87
  Bottom 0.635: 84.23,80.97 84.23,80.06 85.55,78.74 85.55,78.03 SPI.1 | 84.23,80.97 86.06,82.8 v90.93,82.8 93.98,82.8 97.84,78.94 106.78,78.94 111.45,74.27 111.76,74.27 v123.95,62.08 | v67.77,84.33 67.87,84.43 73.05,84.43 76.4,81.08 83.92,81.08 84.23,80.97 | v82.8,141.94 86.16,141.94 89.61,145.39 89.61,149.45 89.31,149.76 82.6,149.76 81.38,148.54 80.67,148.54 SV28.7 | J4.1 9.96,147.62 v9.96,140.61 10.26,140.51 10.77,140.51 20.22,131.06 v26.42,131.06 | X4.10 12.7,104.55 14.02,103.23 | 14.02,103.23 14.02,102.11 13.21,101.3 12.19,101.3 11.38,100.48 11.38,99.16 11.48,99.06 11.48,97.84 11.38,97.74 11.38,96.42 12.7,95.1 X4.6 | 50.39,122.43 v50.39,127.41 53.54,127.41 58.32,132.18 59.64,132.18 | 50.39,122.43 v50.39,121.72 | 50.39,122.43 46.94,122.43 42.67,126.69 v41.55,126.69 | 59.64,132.18 v64.62,132.18 | v14.43,103.33 14.33,103.33 14.02,103.23 | v59.33,139.6 59.33,137.97 59.64,137.67 59.64,132.18 | v72.95,120.8 72.95,111.05 68.89,106.98 68.89,105.87 QG1.14 | ADCB.2 153.52,148.84 | 153.52,148.84 PINS.12 | v163.07,149.96 163.27,150.16 170.38,150.16 171.4,149.15 173.74,149.15 ADCA.2 | v159.11,119.28 155.45,119.28 154.74,118.57 154.74,116.23 J7.P$92 | v140.11,119.58 137.97,119.58 136.45,118.06 J7.P$77 | v153.52,144.37 153.52,148.84 | v195.38,27.23 195.38,52.63 193.85,54.15 v193.85,60.96 193.75,61.27 192.94,62.08 v192.94,64.21 | v125.37,68.89 125.37,73.25 130.05,77.93 IC3.20 130.35,78.03 131.57,79.25 132.99,79.25 | 132.99,79.25 133.81,78.44 133.81,77.62 134.72,76.71 140.61,76.71 141.43,77.52 141.43,78.33 142.34,79.25 153.31,79.25 154.53,78.03 158.19,78.03 IC1.20 | v128.83,119.28 125.58,116.03 125.58,107.59 126.69,106.48 126.69,97.74 132.38,92.05 134.52,92.05 136.45,90.12 136.45,82.91 133.1,79.55 132.99,79.25
ADCA0  (via drill 0.38)
  Top 0.203: v116.84,109.12 v114.5,109.12 | v121.82,104.14 v119.48,106.48 | v127.91,92.25 127.91,88.9 v129.74,87.07 | v148.95,84.94 v135.53,84.94 | v163.07,86.06 163.07,85.45 161.65,84.02 161.65,80.87 162.05,80.47 165.61,80.47 173.13,87.99 175.06,87.99 v175.36,87.68 | v193.45,125.88 200.25,132.69 200.25,146.71 199.24,147.73 196.09,147.73 193.65,150.16 184.91,150.16 183.9,149.15 ADCA.10
  Bottom 0.203: v114.5,109.12 113.08,110.54 113.08,112.17 111.76,113.49 111.76,114.61 112.47,115.32 112.47,116.64 111.76,117.35 111.76,117.96 110.64,119.08 109.83,119.08 109.22,118.47 109.22,118.16 108.1,117.04 107.29,117.04 106.38,117.96 105.16,117.96 J7.P$57 | v119.48,106.48 v116.84,109.12 | v121.82,104.14 121.82,100.89 127.91,94.79 v127.91,92.25 | v129.74,87.07 133.4,87.07 v135.53,84.94 | v148.95,84.94 157.99,84.94 159.11,86.06 v163.07,86.06 | v175.36,87.68 175.77,87.68 178.21,90.12 180.03,90.12 182.78,92.86 182.78,102.72 193.45,113.39 v193.45,125.88
ADCA1  (via drill 0.38)
  Top 0.203: v100.89,120.9 v104.85,120.9 | v98.35,119.58 95.91,119.58 94.79,120.7 93.67,120.7 90.63,117.65 84.73,117.65 72.44,105.36 72.44,88.19 68.89,84.63 68.89,81.99 v69.19,81.69 | v83.11,55.88 100.79,38.2 100.79,37.59 104.14,34.24 169.67,34.24 173.43,38 173.43,40.23 v185.32,52.12 | v187.25,73.05 187.25,82.7 194.56,90.02 194.77,90.02 195.48,90.73 195.48,101.6 194.36,102.72 194.06,102.72 193.45,103.33 193.45,104.14 194.56,105.26 194.77,105.26 213.66,124.16 213.66,130.96 v202.18,142.44
  Bottom 0.203: v104.85,120.9 J7.P$59 | v100.89,120.9 99.67,120.9 v98.35,119.58 | v69.19,81.69 72.95,81.69 83.11,71.53 v83.11,55.88 | v185.32,52.12 189.38,56.19 189.69,56.19 190.19,56.69 190.19,70.1 v187.25,73.05 | v202.18,142.44 202.18,147.32 199.54,149.96 188.87,149.96 186.54,147.62 184.91,147.62 183.9,146.61 ADCA.9
ADCA2  (via drill 0.38)
  Top 0.203: v110.03,91.03 110.03,79.45 v109.93,79.35
  Bottom 0.203: J7.P$61 110.24,115.62 109.22,114.61 109.22,113.49 110.03,112.67 v110.03,91.03 | v109.93,79.35 109.93,78.94 112.17,76.71 112.17,75.18 148.13,39.22 149.56,39.22 150.57,38.2 150.57,37.59 161.65,26.52 209.7,26.52 220.88,37.69 220.88,65.63 221.39,66.14 221.39,134.01 210.21,145.19 204.93,145.19 199.75,150.37 182.57,150.37 181.36,149.15 ADCA.8
ADCA3  (via drill 0.38)
  Top 0.203: v113.59,119.69 114.91,119.69 v115.82,120.6 | v137.26,135.03 v129.64,142.65 | v142.95,128.32 142.95,127.2 140.51,124.77 140.51,123.14 142.44,121.21 155.25,121.21 v156.87,122.83 | v175.87,131.17 v171.4,126.69 | v187.15,139.19 187.66,139.7 187.66,141.53 v185.22,143.97
  Bottom 0.203: J7.P$63 112.78,118.87 v113.59,119.69 | v115.82,120.6 121.31,126.09 121.31,138.07 122.33,139.09 122.83,139.09 123.85,140.11 123.85,140.61 125.88,142.65 v129.64,142.65 | v137.26,135.03 137.26,134.01 v142.95,128.32 | v156.87,122.83 160.32,122.83 164.19,126.69 v171.4,126.69 | v175.87,131.17 179.12,131.17 v187.15,139.19 | v185.22,143.97 183.9,143.97 181.36,146.51 ADCA.7
ADCA4  (via drill 0.38)
  Top 0.203: v103.02,118.77 103.33,119.08 113.18,119.08 114.2,118.06 J7.P$65 | v108.61,102.72 109.42,102.72 110.64,103.94 113.18,103.94 117.14,99.97 v121.72,99.97 | v130.25,91.85 132.69,89.41 137.67,89.41 139.8,91.54 152.09,91.54 152.3,91.34 156.57,91.34 v157.28,92.05 | v192.74,123.14 192.74,123.55 201.07,131.88 201.07,149.05 199.54,150.57 180.24,150.57 178.82,149.15 ADCA.6
  Bottom 0.203: v103.02,118.77 103.02,113.08 102.92,112.98 102.92,111.96 107.8,107.09 107.8,103.53 v108.61,102.72 | v121.72,99.97 121.72,97.43 127.61,91.54 129.95,91.54 v130.25,91.85 | v157.28,92.05 170.79,92.05 174.45,95.71 175.16,95.71 192.74,113.28 v192.74,123.14
ADCA5  (via drill 0.38)
  Top 0.203: v123.04,120.09 120.8,120.09 118.77,118.06 J7.P$67 | v126.09,120.09 126.9,120.09 127.81,121.01 v133.5,121.01 | v142.95,122.33 151.59,122.33 v152.71,123.44 | v177.8,141.33 178.41,141.33 179.02,141.94 v181.36,141.94
  Bottom 0.203: v126.09,120.09 v123.04,120.09 | v133.5,121.01 135.13,121.01 136.55,122.43 138.28,122.43 138.38,122.33 v142.95,122.33 | v152.71,123.44 152.71,124.36 159.41,131.06 159.41,131.17 159.82,131.57 170.59,131.57 172.21,129.95 172.82,129.95 177.8,134.93 v177.8,141.33 | v181.36,141.94 181.36,143.97 178.82,146.51 ADCA.5
ADCA6  (via drill 0.38)
  Top 0.203: v124.87,119.38 124.87,119.89 127,122.02 v130.05,122.02 | v141.22,124.46 141.22,123.04 142.65,121.61 152.71,121.61 v156.36,125.27 | v162.56,124.05 v160.93,125.68 | v192.74,139.09 192.74,141.83 186.54,148.03 177.29,148.03 176.28,149.05 ADCA.4
  Bottom 0.203: v124.87,119.38 122.83,119.38 121.51,118.06 J7.P$69 | v130.05,122.02 132.18,124.16 140.92,124.16 v141.22,124.46 | v156.36,125.27 156.77,125.27 157.18,125.68 v160.93,125.68 | v162.56,124.05 167.74,124.05 168.45,124.77 176.17,124.77 190.5,139.09 v192.74,139.09
ADCA7  (via drill 0.38)
  Top 0.203: J7.P$71 122.94,116.03 123.85,115.11 124.97,115.11 127.71,117.86 128.32,117.86 130.45,115.72 v130.45,115.52 | v127.51,109.93 128.32,109.93 v128.93,109.32 | v134.82,99.87 v129.74,99.87 | v136.65,98.04 148.03,98.04 149.45,99.47 156.67,99.47 v161.34,104.14 | v173.84,111.66 v172.41,110.24 | v174.55,117.86 174.55,121.51 168.96,127.1 168.96,128.52 v172.01,131.57 | v174.85,144.27 174.85,145.09 176.28,146.51 ADCA.3
  Bottom 0.203: v130.45,115.52 127.51,112.57 v127.51,109.93 | v128.93,109.32 129.74,108.51 v129.74,99.87 | v136.65,98.04 v134.82,99.87 | v161.34,104.14 166.32,104.14 v172.41,110.24 | v173.84,111.66 173.84,115.11 174.55,115.82 v174.55,117.86 | v172.01,131.57 172.01,141.43 v174.85,144.27
ADCB0  (via drill 0.38)
  Top 0.203: U16.P$2 U16.P$1 156.97,142.04 160.73,145.8 160.73,146.81 159.82,147.73 156.06,147.73 152.91,150.88 135.74,150.88 133.81,148.95 133.81,148.34 133.2,147.73 132.28,147.73 131.27,148.74 131.27,149.35 130.66,149.96 127.61,149.96 v127.41,149.76
  Bottom 0.203: v127.41,149.76 127.41,149.45 122.63,144.68 119.18,144.68 109.32,134.82 109.32,126.39 104.14,121.21 104.14,115.32 105.16,114.3 J7.P$7
ADCB0_5V
  Top 0.203: R9.2 167.23,140.61 167.23,144.78 166.12,145.9 166.12,147.73 167.23,148.84 ADCB.10
ADCB1  (via drill 0.38)
  Top 0.203: U16.P$6 U16.P$7 156.97,132.79 160.43,129.34 160.43,127.2 v169.67,117.96 | v163.78,106.88 v163.78,109.93 | v159.61,105.66 159.21,105.66 154.23,100.69 148.64,100.69 147.32,102.01 138.38,102.01 137.77,101.4 116.94,101.4 113.59,104.75 110.03,104.75 109.42,104.14 v100.58,104.14 | v102.21,112.57 102.72,112.57 103.33,111.96 104.65,111.96 106.88,114.2 107.7,114.2 J7.P$9
  Bottom 0.203: v169.67,117.96 169.67,117.55 170.89,116.33 170.89,114 167.64,110.74 164.59,110.74 v163.78,109.93 | v163.78,106.88 160.83,106.88 v159.61,105.66 | v100.58,104.14 100.58,105.56 102.31,107.29 102.31,110.03 100.79,111.56 100.79,112.17 101.19,112.57 v102.21,112.57
ADCB1_5V
  Top 0.203: R11.2 173.53,140.61 173.03,140.61 167.34,146.3 ADCB.9
ADCB2  (via drill 0.38)
  Top 0.203: U16.P$9 162.56,136.35 U16.P$8 162.66,136.25 162.66,136.04 165,133.71 165,131.88 166.22,130.66 v168.45,130.66 | v173.63,125.48 173.63,123.04 179.02,117.65 v179.02,116.43 | v134.01,97.33 131.67,97.33 130.96,98.04 129.95,98.04 v129.74,97.84 | v128.93,108.31 123.75,108.31 123.44,108 113.59,108 v111.96,109.63
  Bottom 0.203: v173.63,125.48 v168.45,130.66 | v179.02,116.43 179.02,100.28 174.85,96.11 166.12,96.11 165.51,95.5 156.67,95.5 156.26,95.91 142.44,95.91 141.02,97.33 v134.01,97.33 | v129.74,97.84 129.74,98.86 128.93,99.67 v128.93,108.31 | v111.96,109.63 111.96,110.44 110.44,111.96 110.44,114 110.24,114.2 J7.P$11
ADCB2_5V
  Top 0.203: R13.2 179.93,140.61 175.87,140.61 171.3,145.19 169.37,145.19 168.35,146.2 168.35,149.35 167.74,149.96 165.91,149.96 164.79,148.84 ADCB.8
ADCB3  (via drill 0.38)
  Top 0.203: U16.P$14 162.56,139.6 U16.P$13 162.46,139.6 v161.04,139.6 | v119.18,117.45 119.48,117.14 119.58,117.14 120.09,116.64 120.09,115.72 119.48,115.11 118.36,115.11 118.26,115.21 117.04,115.21 116.94,115.11 115.82,115.11 115.72,115.21 114.5,115.21 113.59,114.3 112.78,114.3 J7.P$13
  Bottom 0.203: v161.04,139.6 157.28,139.6 150.67,146.2 150.67,149.35 150.06,149.96 137.97,149.96 135.43,147.42 134.82,147.42 133.81,146.41 133.81,145.8 129.34,141.33 127.1,141.33 126.09,140.31 126.09,139.8 125.07,138.79 124.56,138.79 123.55,137.77 123.55,122.94 119.18,118.57 v119.18,117.45
ADCB3_5V
  Top 0.203: R15.2 186.23,140.51 182.17,140.51 181.05,139.4 166.22,139.4 164.79,140.82 164.79,146.3 ADCB.7
ADCB4
  Bottom 0.203: J7.P$15 115.32,116.64 114.3,117.65 114.3,139.19 119.38,144.27 122.94,144.27 128.22,149.56 128.22,149.66 129.44,150.88 160.12,150.88 162.15,148.84 ADCB.6
ADCB5  (via drill 0.38)
  Top 0.203: v115.72,110.03 121.82,110.03 v123.14,108.71 | v125.78,106.07 134.11,106.07 v137.47,102.72 | v160.12,100.89 v156.67,97.43 | v173.94,103.33 201.47,130.86 201.47,149.25 199.75,150.98 165.3,150.98 163.27,148.95 163.27,147.32 162.25,146.3 ADCB.5
  Bottom 0.203: J7.P$17 117.86,113.39 117.55,113.08 117.55,111.86 v115.72,110.03 | v125.78,106.07 v123.14,108.71 | v137.47,102.72 143.46,96.72 150.16,96.72 151.18,97.74 156.36,97.74 v156.67,97.43 | v160.12,100.89 171.5,100.89 v173.94,103.33
ADCB6  (via drill 0.38)
  Top 0.203: J7.P$19 120.4,115.42 120.7,115.72 120.7,116.94 121.41,117.65 v121.41,119.38 | v136.85,124.87 v126.09,124.87 | v142.95,125.17 147.42,125.17 148.03,124.56 151.89,124.56 v154.53,127.2 | v174.14,144.98 174.85,145.69 174.85,147.42 174.65,147.62 v169.06,147.62
  Bottom 0.203: v121.41,119.38 121.41,120.19 v126.09,124.87 | v136.85,124.87 140.61,124.87 140.92,125.17 v142.95,125.17 | v154.53,127.2 154.84,127.2 160.53,132.89 162.05,132.89 v174.14,144.98 | v169.06,147.62 160.93,147.62 159.72,148.84 ADCB.4
ADCB7  (via drill 0.38)
  Top 0.203: v134.11,91.14 138.79,91.14 140,92.35 v152.91,92.35 | v155.96,95.2 155.96,97.74 162.05,103.83 162.05,109.02 v161.95,109.12 | v167.13,119.48 166.12,119.48 155.14,130.45 155.14,137.36 v155.25,137.47 | v155.25,139.09 155.25,141.02 159.61,145.39 159.61,146.3 ADCB.3
  Bottom 0.203: J7.P$21 122.94,111.66 121.01,109.73 121.01,97.54 127.41,91.14 132.38,91.14 132.49,91.24 134.01,91.24 v134.11,91.14 | v152.91,92.35 155.75,95.2 v155.96,95.2 | v161.95,109.12 164.19,111.35 167.64,111.35 170.49,114.2 170.49,116.13 v167.13,119.48 | v155.25,139.09 v155.25,137.47
ADCINA0  (via drill 0.38)
  Top 0.203: v106.88,82.7 106.68,82.5 106.68,81.58 106.98,81.28 107.8,81.28 U3.21 | v94.59,76.81 v97.94,80.16
  Bottom 0.203: v106.88,82.7 100.48,82.7 v97.94,80.16 | v94.59,76.81 94.59,72.44 91.75,69.6 91.75,68.99 90.83,68.07 89.31,68.07 88.19,66.95 ADC_I2C.8
AMP_CURRENT_1  (via drill 0.38)
  Top 0.203: v184.81,71.93 184.81,79.15 186.03,80.37 186.03,81.38 AMP_CURRENT.1 | v183.39,57.91 183.39,51.1 170.49,38.2 170.49,37.59 167.54,34.65 104.75,34.65 v104.44,34.95
  Bottom 0.203: AMP_1.S_4 SV1.4 14.83,36.98 16.15,36.98 28.96,24.18 90.83,24.18 91.03,24.38 91.03,24.59 101.4,34.95 v104.44,34.95 | v184.81,71.93 184.81,59.33 v183.39,57.91
AMP_CURRENT_2  (via drill 0.38)
  Top 0.203: v184.1,72.64 v184.1,77.42 | v184.1,59.64 184.1,54.36 186.03,52.43 186.03,40.34 185.62,39.93 185.62,39.32 189.79,35.15 189.79,34.14 188.87,33.22 181.56,33.22 180.03,31.7 87.99,31.7 81.58,38.1 SV2.4
  Bottom 0.203: AMP_2.S_4 81.58,59.64 81.58,38.1 SV2.4 | v184.1,77.42 185.52,78.84 186.03,78.84 AMP_CURRENT.2 | v184.1,59.64 v184.1,72.64
AMP_CURRENT_3
  Top 0.203: AMP_3.S_4 149.15,59.64 149.15,38.1 SV3.4
  Bottom 0.203: AMP_3.S_4 150.06,58.73 157.18,58.73 157.68,59.23 157.68,59.54 158.8,60.66 163.68,60.66 167.64,64.62 167.64,66.95 164.9,69.7 164.9,78.44 165.41,78.94 181.56,78.94 184.1,76.4 186.03,76.4 AMP_CURRENT.3
AMP_CURRENT_4
  Bottom 0.203: SV4.4 AMP_4.S_4 211.84,59.74 197.81,73.76 186.13,73.76 AMP_CURRENT.4
AMP_CURRENT_5
  Top 0.203: AMP_CURRENT.5 186.13,71.32 186.54,71.32 187.96,72.75 187.96,75.79 194.36,82.19 194.36,83.41 AMP_5.S_4 194.46,83.41 219.76,83.41 SV5.4
BRAKE_GND_1
  Bottom 0.203: X4.15 26.42,84.73 29.87,88.19 40.84,88.19 54.36,101.7 81.69,101.7 93.98,114 93.98,115.01 95.3,116.33 95.3,116.94 96.52,118.16 96.52,118.77 104.95,127.2 106.38,127.2 107.09,127.91 107.09,145.39 109.02,147.32 Q3.2
BRAKE_GND_2
  Bottom 0.203: X4.16 10.16,88.09 8.64,89.61 8.64,112.37 22.86,126.59 39.83,126.59 46.13,132.89 48.97,132.89 63.91,147.83 63.91,149.15 65.23,150.47 116.64,150.47 119.58,147.52 119.58,147.32 Q4.2
BRAKE_PWR
  Top 0.203: X4.14 10.16,83.21 9.04,84.33 9.04,110.03 10.26,111.25 10.67,111.25 12.7,113.28 X4.13 12.7,113.79 15.54,116.64 15.54,129.64 29.97,144.07 35.26,144.07 42.16,150.98 95.81,150.98 99.47,147.32 BREAK_POWER.P$2
CANRXA  (via drill 0.38)
  Top 0.203: v147.01,101.3 138.68,101.3 v138.28,100.89 | v132.99,103.73 122.43,103.73 122.12,103.43 117.96,103.43 114.61,106.78 102.41,106.78 102.11,106.48 92.96,106.48 v87.68,111.76 | v126.39,149.76 127.1,150.47 131.06,150.47 132.69,148.84 CAN.4
  Bottom 0.203: v147.01,101.3 157.18,111.45 157.18,112.27 J7.P$44 | v138.28,100.89 135.43,100.89 132.99,103.33 v132.99,103.73 | v87.68,111.76 87.68,113.39 86.77,114.3 86.77,127.61 105.36,146.2 105.36,148.64 106.07,149.35 112.57,149.35 116.64,145.29 122.63,145.29 126.39,149.05 v126.39,149.76
CANTXA
  Top 0.203: J7.P$94 157.28,116.23 157.28,122.22 157.58,122.53 157.58,125.17 151.79,130.96 151.59,130.96 150.88,131.67 150.88,139.5 150.47,139.9 146.3,139.9 145.39,140.82 145.39,141.43 141.63,145.19 141.53,145.19 140.51,146.2 140.51,147.22 140.31,147.42 133.91,147.42 132.79,146.3 CAN.3
ENC1A  (via drill 0.38)
  Top 0.203: v143.26,116.64 143.76,117.14 144.98,117.14 145.09,117.04 146.2,117.04 146.3,117.14 147.52,117.14 147.62,117.04 148.74,117.04 148.84,117.14 150.06,117.14 150.57,116.64 150.57,116.33 152.09,114.81 152.09,112.37 J7.P$40
  Bottom 0.203: v143.26,116.64 144.27,117.65 144.27,122.53 144.07,122.73 144.07,129.24 146.91,132.08 28335_ENC.5
ENC1B
  Bottom 0.203: J7.P$90 152.09,116.23 152.09,123.04 151.99,123.14 151.99,132.08 28335_ENC.9
ENC2A  (via drill 0.38)
  Top 0.203: v147.83,129.03 v147.83,127
  Bottom 0.203: J7.P$35 145.8,116.64 146.81,117.65 146.81,125.98 v147.83,127 | v147.83,129.03 147.83,129.34 147.12,130.05 147.12,130.66 148.03,131.57 148.03,133.6 147.01,134.62 28335_ENC.6
ENC2B
  Bottom 0.203: J7.P$85 145.8,125.98 150.88,131.06 150.88,133.5 151.99,134.62 28335_ENC.10
FAULT_1
  Top 0.203: 34.9,58.78 34.04,59.64 AMP_1.S_12 | 34.9,58.78 34.95,58.73 44.6,58.73 45.41,59.54 54.05,59.54 R8.2 54.15,59.54 61.67,59.54 82.6,38.61 82.6,38 87.78,32.82 168.86,32.82 170.69,34.65 188.67,34.65 INHIBIT_LED.2 | SV1.12 34.04,57.91 34.9,58.78
FAULT_2
  Top 0.203: R18.2 121.92,61.87 120.65,60.6 | 120.65,60.6 120.6,60.55 120.6,58.22 LED_5V1.A | 120.65,60.6 120.6,60.66 103.94,60.66 103.02,59.74 101.91,59.74 AMP_2.S_12 101.91,59.64 101.91,38.1 SV2.12
FAULT_3
  Top 0.203: R20.2 189.28,59.54 189.28,57.2 LED_5V2.A | SV3.12 169.47,38.1 169.47,59.64 AMP_3.S_12